# EAGLE design SparkFun_6DoF_LSM6DSV16X (EAGLE 9.6.2)
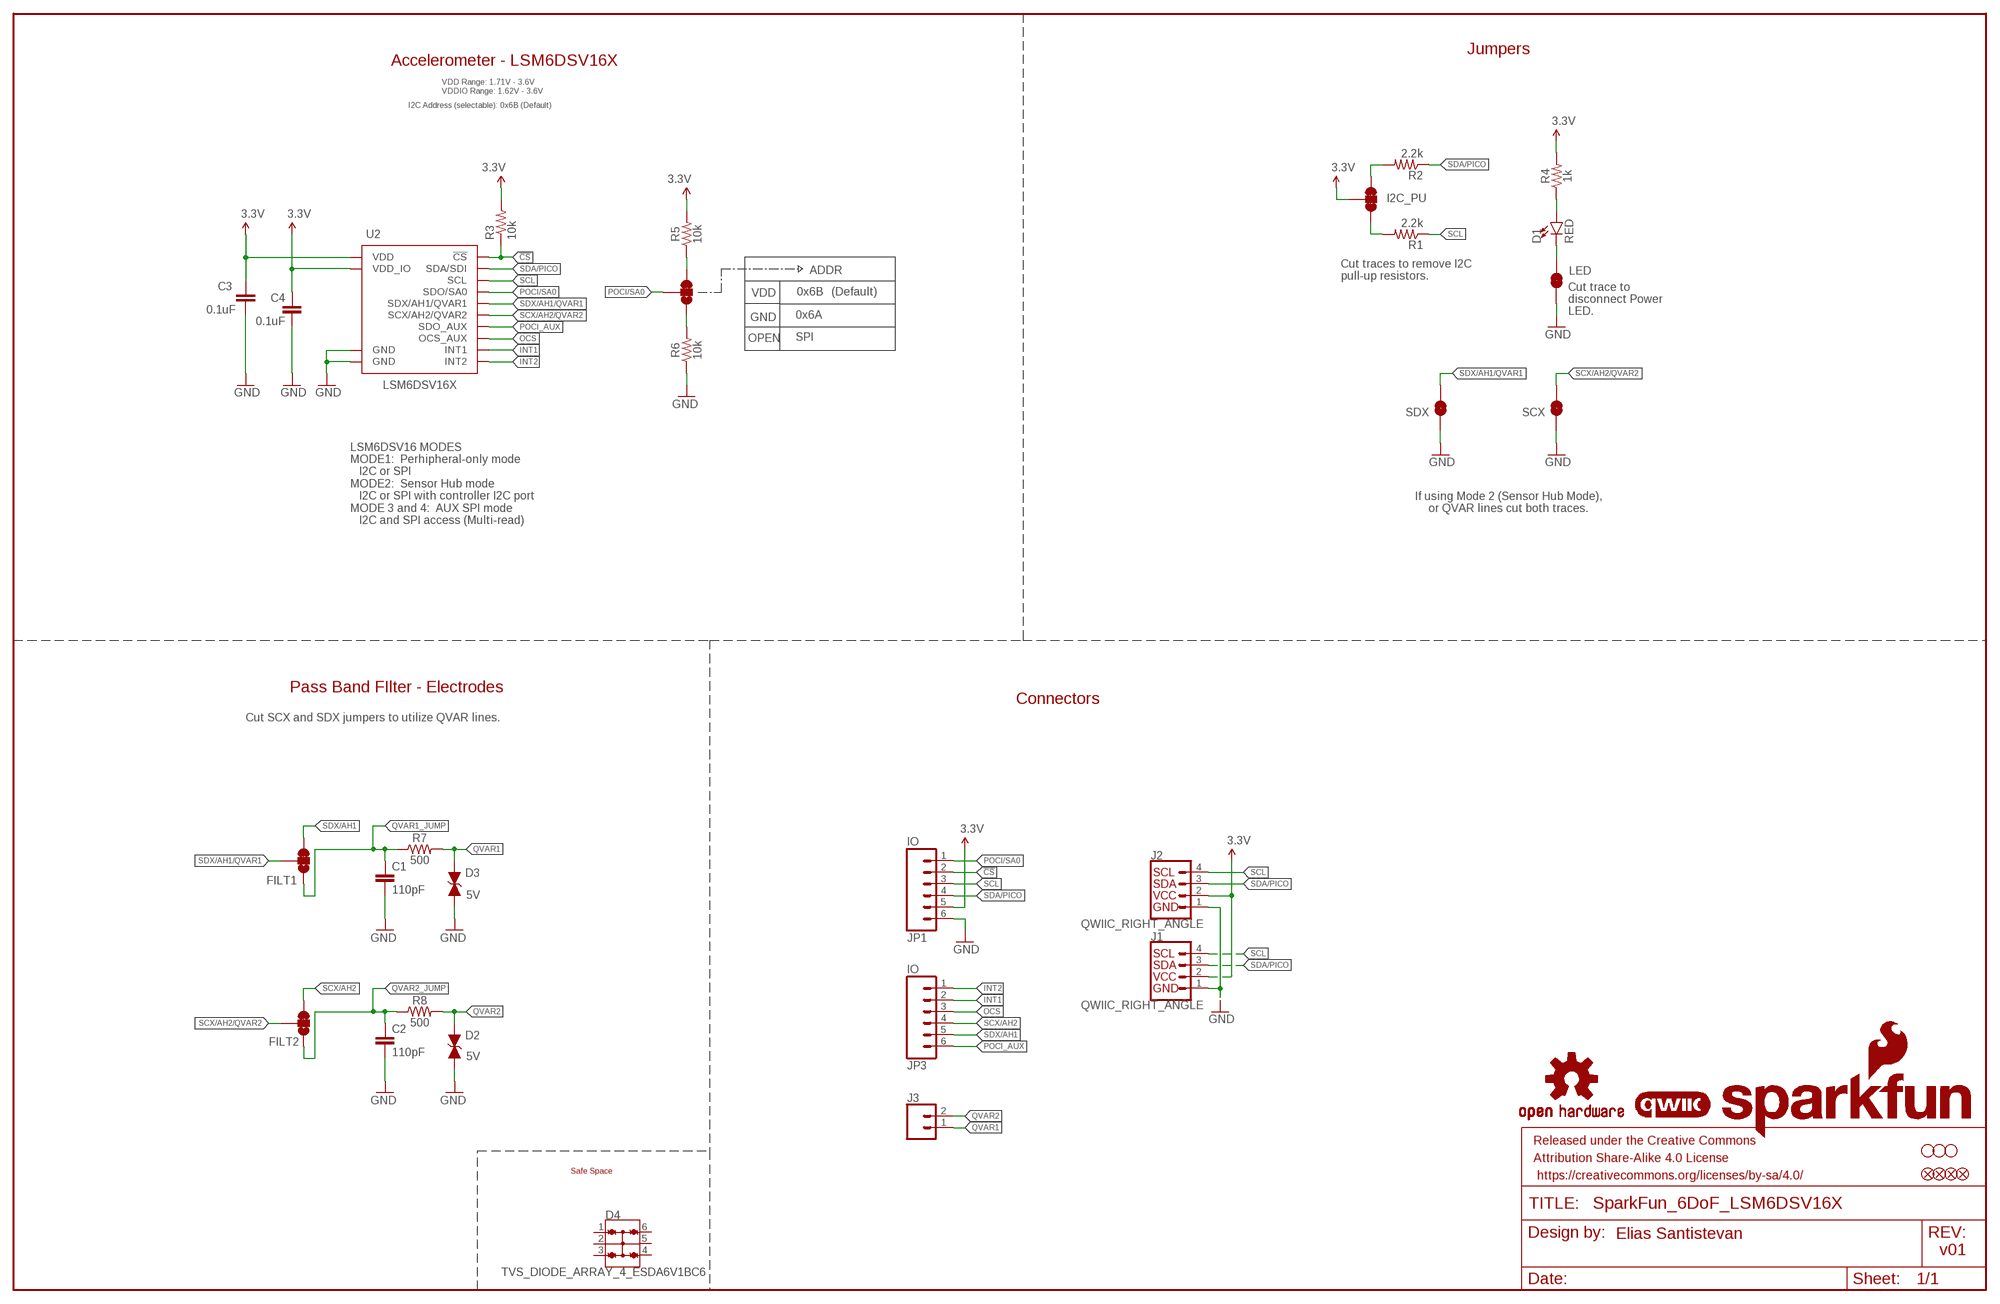
[diagram p0: schematic, sheet 1]

## Parts
ADDR  JUMPER-SMT_3_1-NC_TRACE_SILK  [SMT-JUMPER_3_1-NC_TRACE_SILK]
C1  110pF  110PF-0603-50V-5%  [0603]
C2  110pF  110PF-0603-50V-5%  [0603]
C3  0.1uF  0.1UF-0603-25V-(+80/-20%)  [0603]
C4  0.1uF  0.1UF-0603-25V-(+80/-20%)  [0603]
D1  RED  LED-RED0603  [LED-0603]
D2  5V  ESDALCL5-1BM2  [0603]
D3  5V  ESDALCL5-1BM2  [0603]
D4  TVS_DIODE_ARRAY_4_ESDA6V1BC6  [SOT23-6L]
FD1  FIDUCIALUFIDUCIAL  [FIDUCIAL-MICRO]
FD2  FIDUCIALUFIDUCIAL  [FIDUCIAL-MICRO]
FID1  FIDUCIALUFIDUCIAL  [FIDUCIAL-MICRO]
FID2  FIDUCIALUFIDUCIAL  [FIDUCIAL-MICRO]
FILT1  JUMPER-SMT_3_1-NC_TRACE_SILK  [SMT-JUMPER_3_1-NC_TRACE_SILK]
FILT2  JUMPER-SMT_3_1-NC_TRACE_SILK  [SMT-JUMPER_3_1-NC_TRACE_SILK]
FRAME2  FRAME-LEDGER  [CREATIVE_COMMONS]
I2C_PU  S_MODE  JUMPER-SMT_3_2-NC_TRACE_SILK  [SMT-JUMPER_3_2-NC_TRACE_SILK]
J1  QWIIC_RIGHT_ANGLE  QWIIC_CONNECTORJS-1MM  [JST04_1MM_RA]
J2  QWIIC_RIGHT_ANGLE  QWIIC_CONNECTORJS-1MM  [JST04_1MM_RA]
J3  CONN_021X02_NO_SILK  [1X02_NO_SILK]
JP1  IO  CONN_06NO_SILK_NO_POP  [1X06_NO_SILK]
JP3  IO  CONN_06NO_SILK_NO_POP  [1X06_NO_SILK]
LED  JUMPER-SMT_2_NC_TRACE_SILK  [SMT-JUMPER_2_NC_TRACE_SILK]
LOGO1  QWIIC_LOGO_4MM  [QWIIC_4MM]
LOGO2  OSHW-LOGOMINI  [OSHW-LOGO-MINI]
LOGO3  SFE_LOGO_NAME_FLAME.1_INCH  [SFE_LOGO_NAME_FLAME_.1]
R1  2.2k  2.2KOHM-0603-1/10W-1%  [0603]
R2  2.2k  2.2KOHM-0603-1/10W-1%  [0603]
R3  10k  10KOHM-0603-1/10W-1%  [0603]
R4  1k  1KOHM-0603-1/10W-1%  [0603]
R5  10k  10KOHM-0603-1/10W-1%  [0603]
R6  10k  10KOHM-0603-1/10W-1%  [0603]
R7  500  500OHM-0603-1/10W-1%  [0603]
R8  500  500OHM-0603-1/10W-1%  [0603]
SCX  JUMPER-SMT_2_NC_TRACE_SILK  [SMT-JUMPER_2_NC_TRACE_SILK]
SDX  JUMPER-SMT_2_NC_TRACE_SILK  [SMT-JUMPER_2_NC_TRACE_SILK]
STANDOFF1  STAND-OFFTIGHT  [STAND-OFF-TIGHT]
STANDOFF2  STAND-OFFTIGHT  [STAND-OFF-TIGHT]
STANDOFF3  STAND-OFFTIGHT  [STAND-OFF-TIGHT]
U2  LSM6DSV16X  [LGA-14L]

## Nets
3.3V: C3.1 C4.1 I2C_PU.2 J1.2 J2.2 JP1.5 R3.2 R4.2 R5.2 U2.P5(VDD_IO) U2.P8(VDD)
!CS!: JP1.2 R3.1 U2.P12(!CS!)
GND: C1.2 C2.2 C3.2 C4.2 D2.1(A) D3.1(A) J1.1 J2.1 JP1.6 LED.1 R6.1 SCX.1 SDX.1 U2.P6(GND) U2.P7(GND)
INT1: JP3.2 U2.P4(INT1)
INT2: JP3.1 U2.P9(INT2)
N$1: ADDR.3 R5.1
N$2: D1.A R4.1
N$3: D1.C LED.2
N$5: I2C_PU.1 R1.2
N$6: I2C_PU.3 R2.2
N$7: ADDR.1 R6.2
OCS: JP3.3 U2.P10(OCS_AUX)
POCI/SA0: ADDR.2 JP1.1 U2.P1(SDO/SA0)
POCI_AUX: JP3.6 U2.P11(SDO_AUX)
QVAR1: D3.2(C) J3.1 R7.2
QVAR1_JUMP: C1.1 FILT1.1 R7.1
QVAR2: D2.2(C) J3.2 R8.2
QVAR2_JUMP: C2.1 FILT2.1 R8.1
SCL: J1.4 J2.4 JP1.3 R1.1 U2.P13(SCL)
SCX/AH2: FILT2.3 JP3.4
SCX/AH2/QVAR2: FILT2.2 SCX.2 U2.P3(SCX/AH2/QVAR2)
SDA/PICO: J1.3 J2.3 JP1.4 R2.1 U2.P14(SDA/SDI)
SDX/AH1: FILT1.3 JP3.5
SDX/AH1/QVAR1: FILT1.2 SDX.2 U2.P2(SDX/AH1/QVAR1)
Unconnected: D4.1 D4.2 D4.3 D4.4 D4.5 D4.6

## Notes on the sheet
- Jumpers
- Accelerometer - LSM6DSV16X
- VDD Range: 1.71V - 3.6V
  VDDIO Range: 1.62V - 3.6V
- I2C Address (selectable): 0x6B (Default)
- Cut traces to remove I2C
  pull-up resistors.
- VDD | 0x6B | (Default)
- Cut trace to
  disconnect Power
  LED.
- GND | 0x6A
- OPEN | SPI
- LSM6DSV16 MODES
  MODE1:  Perhipheral-only mode
     I2C or SPI
  MODE2:  Sensor Hub mode
     I2C or SPI with controller I2C port
  MODE 3 and 4:  AUX SPI mode
     I2C and SPI access (Multi-read)
- If using Mode 2 (Sensor Hub Mode), 
  or QVAR lines cut both traces.
- Pass Band FIlter - Electrodes
- Connectors
- Cut SCX and SDX jumpers to utilize QVAR lines.
- Safe Space
- Elias Santistevan
- v01

## Library data of the parts
ADDR FILT1 FILT2 = SparkFun-Jumpers:JUMPER-SMT_3_1-NC_TRACE: Normally closed trace jumper (1 of 2 connections) This jumper has a trace between two pads so it's normally closed (NC). The other connection is normally open (NO). Use a razor knife to open the connection. For best results follow the IPC guidelines for cutting traces: Cutout at least 0.063 mm (0.005 in). Remove all loose material to clean up the cut area. Seal the cut with an approved epoxy. Reapply solder to reclose the connection, or to close the NO connection.
C1 C2 = lsm6dsv16x:110PF: 110pF/0.1nF ceramic capacitors A capacitor is a passive two-terminal electrical component used to store electrical energy temporarily in an electric field.; PROD_ID: CAP-07883
C3 C4 = SparkFun-Capacitors:0.1UF: 0.1µF ceramic capacitors A capacitor is a passive two-terminal electrical component used to store electrical energy temporarily in an electric field.; PROD_ID: CAP-00810
D1 = SparkFun-LED:LED-RED: Red SMD LED Used in manufacturing of most products at SparkFun Packages: 0603 - SMD 0603 package [Product Link] <http://docs.avagotech.com/docs/AV02-0551EN> 0603 SMART - SMD 0603 SMART package ( more efficient and expensive)[Product Link] <http://www.osram-os.com/Graphics/XPic2/00077099_0.pdf> 1206 - SMD1206 package [Product Link] <https://www.sparkfun.com/datasheets/DevTools/LilyPad/Q150OVS4.pdff> SparkFun Products: Pro Mini 328 -5V <https://www.sparkfun.com/products/821> RedBoard <https://www.sparkfun.com/products/12757> IOIO-OTG <https://www.sparkfun.com/products/13613>; PROD_ID: DIO-00819
D2 D3 = lsm6dsv16x:ESDALCL5-1BM2: ESDALCL5-1BM2 The ESDALCL5-1BM2 is a bidirectional single- line TVS diode designed to protect data lines or other I/O ports against ESD transients.
D4 = SparkFun-DiscreteSemi:TVS_DIODE_ARRAY_4; PROD_ID: DIO-14095
FD1 FD2 FID1 FID2 = SparkFun-Aesthetics:FIDUCIAL: Fiducial Alignment Points Point-of-reference for pick-and-place machines and other optical instruments.
FRAME2 = SparkFun-Aesthetics:FRAME-LEDGER: Schematic Frame - Ledger Standard 11x14 US Ledger frame
I2C_PU = SparkFun-Jumpers:JUMPER-SMT_3_2-NC_TRACE: Normally closed trace jumper (2 of 2 connections) This jumper has a trace between all three pads so they are normally closed (NC). Use a razor knife to open the connection(s). For best results follow the IPC guidelines for cutting traces: Cutout at least 0.063 mm (0.005 in). Remove all loose material to clean up the cut area. Seal the cut with an approved epoxy. Reapply solder to reclose the connection(s).
J1 J2 = SparkFun-Connectors:QWIIC_CONNECTOR: SparkFun I2C Standard Qwiic Connector An SMD 1mm pitch JST connector makes it easy and quick (get it? Qwiic?) to connect I2C devices to each other. The Qwiic system <http://www.sparkfun.com/qwiic> enables fast and solderless connection between popular platforms and various sensors and actuators. We carry 200mm <https://www.sparkfun.com/products/14204>, 100mm <https://www.sparkfun.com/products/14205>, 50mm <https://www.sparkfun.com/products/14206>, and breadboard friendly <https://www.sparkfun.com/products/14207> Qwiic cables. We also offer 10 pcs strips <https://www.sparkfun.com/products/14323> the SMD connectors.; PROD_ID: CONN-13694
J3 = SparkFun-Connectors:CONN_02: Multi connection point. Often used as Generic Header-pin footprint for 0.1 inch spaced/style header connections On any of the 0.1 inch spaced packages, you can populate with these: Break Away Headers - Straight <https://www.sparkfun.com/products/116> (PRT-00116) Break Away Male Headers - Right Angle <https://www.sparkfun.com/products/553> (PRT-00553) Female Headers <https://www.sparkfun.com/products/115> (PRT-00115) Break Away Headers - Machine Pin <https://www.sparkfun.com/products/117> (PRT-00117) Break Away Female Headers - Swiss Machine Pin <https://www.sparkfun.com/products/743> (PRT-00743) For SCREWTERMINALS and SPRING TERMINALS visit here: Screw Terimnals on SparkFun.com <https://www.sparkfun.com/search/results?term=Screw+Terminals> (5mm/3.5mm/2.54mm spacing) This device is also useful as a general connection point to wire up your design to another part of your project. Our various solder wires solder well into these plated through hole pads. Hook-Up Wire - Assortment (Stranded, 22 AWG) <https://www.sparkfun.com/products/11375> (PRT-11375) Hook-Up Wire - Assortment (Solid Core, 22 AWG) <https://www.sparkfun.com/products/11367> (PRT-11367) View the entire wire category on our website here <https://www.sparkfun.com/categories/141> Special notes: Molex polarized connector foot print use with: PRT-08233 with associated crimp pins and housings. 2.54_SCREWTERM for use with PRT-10571. 3.5mm Screw Terminal footprints for PRT-08084 5mm Screw Terminal footprints for use with PRT-08432
JP1 JP3 = SparkFun-Connectors:CONN_06: Multi connection point. Often used as Generic Header-pin footprint for 0.1 inch spaced/style header connections On any of the 0.1 inch spaced packages, you can populate with these: Break Away Headers - Straight <https://www.sparkfun.com/products/116> (PRT-00116) Break Away Male Headers - Right Angle <https://www.sparkfun.com/products/553> (PRT-00553) Female Headers <https://www.sparkfun.com/products/115> (PRT-00115) Break Away Headers - Machine Pin <https://www.sparkfun.com/products/117> (PRT-00117) Break Away Female Headers - Swiss Machine Pin <https://www.sparkfun.com/products/743> (PRT-00743) Arduino Stackable Header - 6 Pin <https://www.sparkfun.com/products/9280> (PRT-09280) Screw Terminals 2.54mm Pitch (6-Pin) <https://www.sparkfun.com/products/16499> (PRT-16499) For SCREWTERMINALS and SPRING TERMINALS visit here: Screw Terimnals on SparkFun.com <https://www.sparkfun.com/search/results?term=Screw+Terminals> (5mm/3.5mm/2.54mm spacing) This device is also useful as a general connection point to wire up your design to another part of your project. Our various solder wires solder well into these plated through hole pads. Hook-Up Wire - Assortment (Stranded, 22 AWG) <https://www.sparkfun.com/products/11375> (PRT-11375) Hook-Up Wire - Assortment (Solid Core, 22 AWG) <https://www.sparkfun.com/products/11367> (PRT-11367) View the entire wire category on our website here <https://www.sparkfun.com/categories/141>
LED SCX SDX = SparkFun-Jumpers:JUMPER-SMT_2_NC_TRACE: Normally closed trace jumper This jumper has a trace between two pads so it's normally closed (NC). Use a razor knife to open the connection. For best results follow the IPC guidelines for cutting traces: Cutout at least 0.063 mm (0.005 in). Remove all loose material to clean up the cut area. Seal the cut with an approved epoxy. Reapply solder to reclose the connection.
LOGO1 = SparkFun-Aesthetics:QWIIC_LOGO: Qwiic Logos for placement on schematic and PCB. The 5.5mm silk logo is best for placing next to Qwiic connector.
LOGO2 = SparkFun-Aesthetics:OSHW-LOGO: Open-Source Hardware (OSHW) Logo This logo indicates the piece of hardware it is found on incorporates a OSHW license and/or adheres to the definition of open source hardware found here: http://freedomdefined.org/OSHW
LOGO3 = SparkFun-Aesthetics:SFE_LOGO_NAME_FLAME: SparkFun Font Logo w/ Flame This is the SparkFun full logo. The logo on the schematic will always be the same size; the package variant is the height of the flame part of the logo. Default layer for the logo on the board is tSilk.
R1 R2 = SparkFun-Resistors:2.2KOHM: 2.2kΩ resistor A resistor is a passive two-terminal electrical component that implements electrical resistance as a circuit element. Resistors act to reduce current flow, and, at the same time, act to lower voltage levels within circuits. - Wikipedia; PROD_ID: RES-08272
R3 R5 R6 = SparkFun-Resistors:10KOHM: 10kΩ resistor A resistor is a passive two-terminal electrical component that implements electrical resistance as a circuit element. Resistors act to reduce current flow, and, at the same time, act to lower voltage levels within circuits. - Wikipedia; PROD_ID: RES-00824
R4 = SparkFun-Resistors:1KOHM: 1kΩ resistor A resistor is a passive two-terminal electrical component that implements electrical resistance as a circuit element. Resistors act to reduce current flow, and, at the same time, act to lower voltage levels within circuits. - Wikipedia; PROD_ID: RES-07856
R7 R8 = lsm6dsv16x:500OHM: 500Ω resistor A resistor is a passive two-terminal electrical component that implements electrical resistance as a circuit element. Resistors act to reduce current flow, and, at the same time, act to lower voltage levels within circuits. - Wikipedia
STANDOFF1-STANDOFF3 = SparkFun-Hardware:STAND-OFF: Stand Off Drill holes for mechanically mounting via screws, standoffs, etc. Note: Use the keepout ring to avoid running the screw head into surrounding components. Variant Overviews STAND-OFF - Mechanical footprint for a #4 phillips button head screw. STAND-OFF-TIGHT - Mechanical footprint for a #4 phillips button head screw, Example SparkFun Products Screw - Phillips Head (1/4", 4-40, 10 pack) <https://www.sparkfun.com/products/10453> (PRT-10453) Screw - Phillips Head (1/2", 4-40, 10 pack) <https://www.sparkfun.com/products/10452> (PRT-10452) Screw - Phillips Head (3/4", 4-40, 10 pack) <https://www.sparkfun.com/products/10451> (PRT-10451) Screw - Phillips Head (1", 4-40, 10 pack) <https://www.sparkfun.com/products/10450> (PRT-10450)
U2 = lsm6dsv16x:LSM6DSV16X: STMicroelectronic's LSM6DSV16X 6DoF The LSM6DSV16X is a high-performance, low-power 6-axis IMU, featuring a 3-axis digital accelerometer and a 3-axis digital gyroscope, with a triple core for processing acceleration and angular rate data on three separate channels (user interface, OIS, and EIS) with dedicated configuration, processing, and filtering. The LSM6DSV16X enables processes in edge computing, leveraging embedded advanced dedicated features such as a finite state machine (FSM) for configurable motion tracking and a machine learning core (MLC) for contextual awareness with exportable AI features for IoT applications. The LSM6DSV16X embeds Qvar (electric charge variation detection) for user interface functions like tap, double tap, triple tap, long press, or L/R – R/L swipe. The LSM6DSV16X embeds an analog hub able to connect an external analog input and convert it to a digital signal for processing. Product Page <https://www.st.com/en/mems-and-sensors/lsm6dsv16x.html#overview>; PROD_ID: IC-17274

## Board
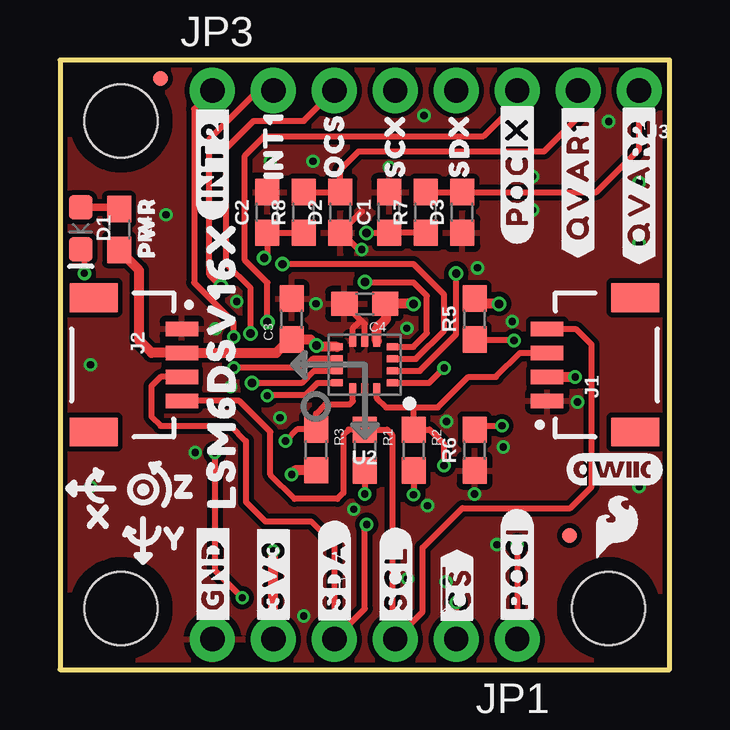
[diagram p1: board, top side]
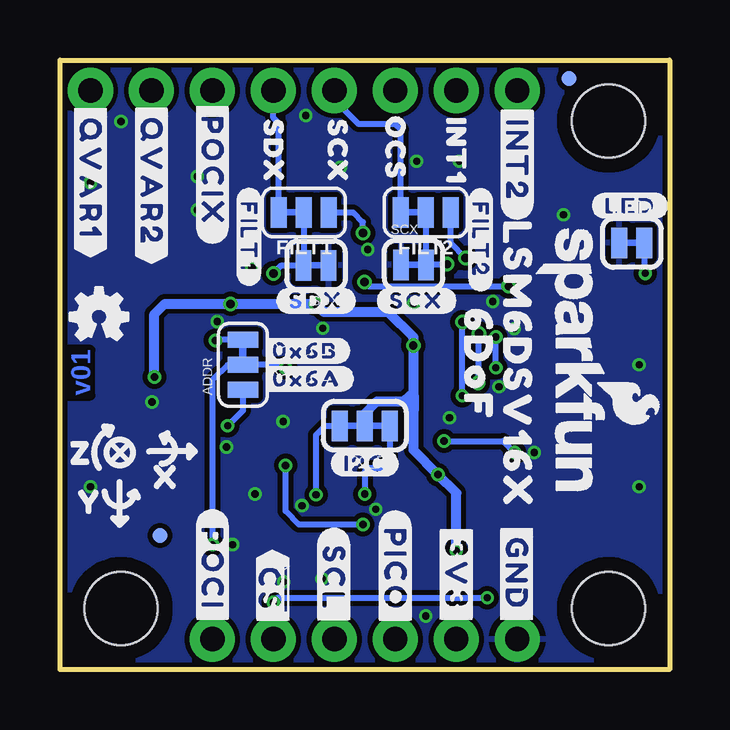
[diagram p2: board, bottom side, seen from below]

Size 25.4 x 25.4 mm. Coordinates in mm from the lower left corner, seen from the top.
Outline: 25.4,25.4 0,25.4 0,0 25.4,0 25.4,25.4
Copper layers (1*16): Top 0.035mm / dielectric 1.5mm / Bottom 0.035mm
Design rules "SparkFun-2-Layer-Minimum-JLCPCB": minimum track width 5mil, minimum drill 0.3mm, track to track 5mil, track to pad 5mil, pad to pad 5mil, via to via 5mil, smd to smd 5mil, copper to edge 7mil, drill to drill 7mil, minimum pad ring 5mil, minimum via ring 5mil, stop-mask expansion 2.5mil, vias tented up to drill 25mil, thermal gap 10mil
tRestrict: area 12.4,13.5 to 12.5,13.8

### Footprints (pad centres in the part's own frame; a part is rotated, then mirrored left to right if it is on the bottom)
SMT-JUMPER_3_1-NC_TRACE_SILK = smd 0.66 x 1.27: 1 -1.041,0; 2 0,0; 3 1.041,0
0603 = smd 1.1 x 1: 1 -0.85,0; 2 0.85,0
LED-0603 = smd 1 x 1: A -0.877,0; C 0.877,0
SOT23-6L = smd 0.6 x 1.2: 1 -0.95,-1.15; 2 0,-1.15; 3 0.95,-1.15; 4 0.95,1.15; 5 0,1.15; 6 -0.95,1.15
FIDUCIAL-MICRO = smd 0.635 x 0.635: 1 0,0
SMT-JUMPER_3_2-NC_TRACE_SILK = smd 0.66 x 1.27: 1 -1.041,0; 2 0,0; 3 1.041,0
JST04_1MM_RA = smd 0.6 x 1.35: 1 -1.5,0; 2 -0.5,0; 3 0.5,0; 4 1.5,0 | smd 1.2 x 2: NC1 2.8,-3.675; NC2 -2.8,-3.675
1X02_NO_SILK = drill 1.016 pad 1.88: 1 0,0; 2 2.54,0
1X06_NO_SILK = drill 1.016 pad 1.88: 1 0,0; 2 2.54,0; 3 5.08,0; 4 7.62,0; 5 10.16,0; 6 12.7,0
SMT-JUMPER_2_NC_TRACE_SILK = smd 0.66 x 1.27: 1 -0.521,0; 2 0.521,0
STAND-OFF-TIGHT = hole 3.048: 0,0
LGA-14L = smd 0.48 x 0.3: P1 -1.163,0.75; P2 -1.163,0.25; P3 -1.163,-0.25; P4 -1.163,-0.75; P8 1.163,-0.75; P9 1.163,-0.25; P10 1.163,0.25; P11 1.163,0.75 | smd 0.3 x 0.48: P5 -0.5,-1; P6 0,-1; P7 0.5,-1; P12 0.5,1; P13 0,1; P14 -0.5,1

### Placement (x,y rotation side)
ADDR  17.78,12.7 90 bottom
C1  13.72,19.05 90 top
C2  8.64,19.05 90 top
C3  9.65,14.61 90 top
C4  12.7,15.24 180 top
D1  0.86,18.39 270 top
D2  11.68,19.05 90 top
D3  16.76,19.05 90 top
D4  53.34,13.97 0 top  (outside the outline)
FD1  4.19,24.64 0 bottom
FD2  21.23,5.59 0 bottom
FID1  4.19,24.64 0 top
FID2  21.23,5.59 0 top
FILT1  15.24,19.05 180 bottom
FILT2  10.16,19.05 180 bottom
FRAME2  -17.78,-12.7 0 top  (outside the outline)
I2C_PU  12.7,10.16 180 bottom
J1  20.29,12.7 90 top
J2  5.08,12.7 270 top
J3  24.13,24.13 180 top
JP1  19.05,1.27 180 top
JP3  6.35,24.13 0 top
LED  1.57,17.78 0 bottom
LOGO1  23.11,8.33 0 top
LOGO2  23.77,14.71 0 bottom
LOGO3  4.12,12.83 270 bottom
R1  12.7,9.14 270 top
R2  14.73,9.14 270 top
R3  10.67,9.16 270 top
R4  2.46,18.34 270 top
R5  17.27,14.61 90 top
R6  17.27,9.14 90 top
R7  15.24,19.05 90 top
R8  10.16,19.05 90 top
SCX  10.67,16.87 0 bottom
SDX  14.73,16.84 180 bottom
STANDOFF1  2.54,22.86 0 top
STANDOFF2  2.54,2.54 0 top
STANDOFF3  22.86,2.54 0 top
U2  12.7,12.7 180 top
U$1  [#3V3#1]  8.89,3.96 90 top
U$2  [#GND#0]  6.38,3.99 90 top
U$3  [##CS##7]  16.54,3.35 90 top
U$4  [#SDA#4]  11.43,3.96 90 top
U$5  [#SCL#5]  14,3.81 90 top
U$6  [#POCI#11]  19.05,4.22 270 bottom
U$7  [INT16]  8.89,21.84 90 top
U$8  [#INT2#2]  6.35,21.21 270 bottom
U$9  [OCS17]  11.43,21.84 90 top
U$10  [SCX18]  13.97,21.84 90 top
U$11  [SDX19]  16.64,21.84 90 top
U$12  [#QVAR1#22]  21.59,20.45 90 top
U$13  [#0X6A#11]  15.11,12.12 0 bottom
U$14  [#0X6B#11]  15.19,13.28 0 bottom
U$15  [#3V3#1]  8.89,3.96 270 bottom
U$16  [#LED#11]  1.65,19.33 0 bottom
U$17  [#GND#0]  6.38,3.99 270 bottom
U$18  [#POCI#12]  19.05,4.22 90 top
U$19  [#QVAR2#22]  24.13,20.32 90 top
U$20  [#QVAR1#31]  24.13,20.45 270 bottom
U$21  [#QVAR2#31]  21.59,20.32 270 bottom
U$22  [#SCL#5]  14,3.81 270 bottom
U$23  [SCX18]  13.84,21.59 270 bottom
U$24  [#POCIX#8]  19.05,20.78 90 top
U$25  [#I2C#11]  12.7,8.59 0 bottom
U$26  [#PICO#13]  11.43,4.17 270 bottom
U$27  [##CS##8]  16.54,3.35 270 bottom
U$28  [PWR8]  3.61,18.41 90 top
U$29  [SFE_LOGO_FLAME_.1]  23.19,5.97 0 top
U$30  [SDX19]  16.51,21.59 270 bottom
U$31  [6DOF12]  7.98,12.7 270 bottom
U$32  [OCS17]  11.43,21.72 270 bottom
U$33  [#POCIX#7]  19.05,20.78 270 bottom
U$34  [X2114]  1.65,6.35 0 top
U$35  [Y2115]  4.83,5.46 0 top
U$36  [Z2116]  5.21,7.62 0 top
U$37  [X2114]  20.95,8 0 bottom
U$38  [Y2115]  24.13,6.99 0 bottom
U$39  [Z2116]  24.51,9.02 0 bottom
U$40  [#INT2#3]  6.35,21.21 90 top
U$41  [INT16]  8.89,21.59 270 bottom
U$42  [#SDX#20]  14.73,15.37 0 bottom
U$43  [#SCX#19]  10.54,15.37 0 bottom
U$44  [#FILT1#21]  17.53,18.03 270 bottom
U$45  [#FILT2#21]  7.87,17.91 270 bottom
U$46  [LSM6DSV16X37]  6.35,12.7 270 bottom
U$47  [LSM6DSV16X37]  6.73,12.7 90 top

### Tracks (layer width: path | path; a pad name or v marks a point on that pad's centre or on a via)
3.3V  (via drill 0.3, 0.35)
  Top 0.254: U2.P5 13.2,13.97 13.2,14.22
  Top 0.406: 13.59,15.24 13.59,14.6 13.2,14.22 U2.P5 | 13.59,15.24 C4.1 | JP1.5 v8.89,4.95 | J1.2 v21.45,12.2 v21.46,12.19 | v14.73,15.24 13.59,15.24 | R4.2 2.46,17.48 3.3,16.64 3.3,13.72 3.82,13.2 J2.2 9.02,13.2 9.57,13.76 C3.1 10.43,13.76 v10.68,13.51 10.74,13.45 U2.P8 | v18.29,15.24 17.49,15.24 R5.2 | R3.2 9.83,8.31 v9.65,8.13
  Bottom 0.406: v8.89,4.95 8.89,7.36 v9.65,8.13 10.67,9.14 10.67,10.79 | 10.67,10.79 11.05,11.18 | v21.46,12.19 21.46,14.81 21.03,15.24 v18.29,15.24 v14.73,15.24 14.4,14.91 11.73,14.91 10.67,13.84 | 10.67,11.43 10.67,13.84 | 10.67,11.43 10.67,10.79 | 11.05,11.18 10.79,11.43 10.67,11.43 | 10.67,13.84 10.68,13.83 v10.68,13.51 | 11.05,11.18 12.19,11.18 12.7,10.67 I2C_PU.2
!CS!  (via drill 0.3)
  Top 0.254: JP1.2 v16.51,2.79 | v6.45,9.04 6.45,4.14 v7.59,3 | U2.P12 12.2,11.18 12.06,11.05 11.05,11.05 10.67,10.67 R3.1 9.88,10.01 v9.4,9.53
  Bottom 0.254: v16.51,2.79 16.31,3 v7.59,3 | v9.4,9.53 6.93,9.53 v6.45,9.04
GND  (via drill 0.3)
  Top 0.254: U2.P7 12.2,14.23 12.53,14.56 | 12.57,19.09 D2.1 11.75,18.2 12.45,17.5 v12.57,17.5 | 12.53,14.56 12.7,14.39 U2.P6 | 12.53,14.56 C4.2
  other vias: 17.27,7.32 10.67,15.24 6.48,14.2 5.64,9.04 9.17,10.49 18.47,9.27 14.45,14.22 19.68,19.15 18.85,14.5 16.08,3.66 18.21,5.21 10.16,2.24 4.42,18.95 21.56,11.15 12.24,6.68 8.76,21.18 10.54,21.18 13.72,20.93 17.4,16.74 19.68,20.55 15.32,6.83 7.11,11.79 16.1,10.34 15.16,23.09 7.37,15.34 14.48,3.78 1.27,12.7 1.27,7.62 24.13,7.62 22.86,22.83 24.13,20.29 24.13,17.75
  pour Bottom (isolate 0.203): 25.4,0 25.4,25.4 0,25.4 0,0
  pour Top (isolate 0.203, rank 2): 25.4,0 25.4,25.4 0,25.4 0,0
INT1  (via drill 0.35)
  Top 0.254: U2.P4 14.72,13.45 15.29,14.02 15.29,15.57 14.73,16.13 12.7,16.13 v12.72,16.14 | v6.7,15.97 6.22,16.45 6.22,22.1 8.26,24.13 JP3.2
  Bottom 0.254: v12.72,16.14 12.55,15.98 v6.71,15.98 v6.7,15.97
INT2  (via drill 0.3)
  Top 0.254: v7.24,12.57 10.16,12.57 10.54,12.95 U2.P9 | v7.24,13.86 7.24,14.48 5.59,16.13 5.59,23.37 JP3.1
  Bottom 0.254: v7.24,12.57 v7.24,13.86
N$1  (via drill 0.3)
  Top 0.254: v18.92,13.72 17.31,13.72 R5.1
  Bottom 0.254: v18.92,13.72 18.9,13.74 ADDR.3
N$2
  Top 0.305: D1.A 2.39,19.27 R4.1
N$3  (via drill 0.3)
  Top 0.254: D1.C 1.02,17.36 v1.02,16.51
  Bottom 0.254: LED.2 1.05,16.55 v1.02,16.51
N$5  (via drill 0.3)
  Top 0.254: R1.2 v12.7,7.32
  Bottom 0.254: I2C_PU.1 11.66,8.79 12.06,8.38 12.57,8.38 12.7,8.26 v12.7,7.32
N$6  (via drill 0.3)
  Top 0.254: R2.2 v14.73,7.29
  Bottom 0.254: v14.73,7.29 14.73,9.78 14.35,10.16 I2C_PU.3
N$7  (via drill 0.3)
  Top 0.254: R6.2 17.44,10.16 v18.41,10.16
  Bottom 0.254: ADDR.1 17.78,10.79 v18.41,10.16
OCS  (via drill 0.35)
  Top 0.254: v7.99,11.94 10.07,11.94 10.58,12.45 U2.P10 | v7.95,14.01 7.95,15.9 6.94,16.91 6.94,21.72 8.08,22.86 10.16,22.86 JP3.3
  Bottom 0.254: v7.99,11.94 7.95,11.99 v7.95,14.01
POCI/SA0  (via drill 0.3)
  Top 0.254: v16,12.57 15.38,11.95 U2.P1 | v19.05,5.21 JP1.1
  Bottom 0.254: v16,12.57 16.14,12.7 ADDR.2 18.41,12.7 19.05,12.07 v19.05,5.21
POCI_AUX  (via drill 0.3, 0.35)
  Top 0.254: v8.64,11.41 8.66,11.43 10.22,11.43 10.74,11.95 U2.P11 | v8.64,14.48 8.64,16.13 7.7,17.07 7.7,21.41 8.51,22.23 17.65,22.23 19.05,23.62 JP3.6
  Bottom 0.254: v8.64,11.41 v8.64,14.48
QVAR1
  Top 0.254: R7.2 D3.2 22.35,19.9 24.13,21.68 J3.1
QVAR1_JUMP  (via drill 0.35)
  Top 0.254: R7.1 C1.1 13.7,18.19 v12.78,18.19
  Bottom 0.254: FILT1.1 13.18,19.05 12.78,18.64 v12.78,18.19
QVAR2
  Top 0.254: R8.2 D2.2 11.68,20.83 12.45,21.59 20.17,21.59 21.59,23.01 J3.2
QVAR2_JUMP  (via drill 0.35)
  Top 0.254: v8.51,17.14 8.64,17.27 C2.1 R8.1
  Bottom 0.254: v8.51,17.14 9.12,17.75 FILT2.1
SCL
  Top 0.254: J1.4 21.49,14.2 22.15,13.54 22.15,7.62 21.26,6.73 16.76,6.73 15.11,5.08 15.11,2.41 JP1.3 13.84,1.4 13.84,9.78 13.63,9.99 R1.1 | R1.1 12.03,9.99 11.81,9.78 11.81,7.37 11.56,7.11 9.78,7.11 8.76,8.13 8.76,9.91 7.47,11.2 J2.4 | U2.P13 R1.1
SCX/AH2
  Bottom 0.254: JP3.4 13.97,23.75 12.95,22.73 11.43,22.73 11.2,22.5 FILT2.3
SCX/AH2/QVAR2  (via drill 0.35)
  Top 0.254: U2.P3 14.83,12.95 16,14.12 16,15.62 14.73,16.89 v9.27,16.89
  Bottom 0.254: v9.27,16.89 9.3,16.87 SCX.2 FILT2.2
SDA/PICO  (via drill 0.3)
  Top 0.254: J1.3 19.17,13.2 18.16,12.19 17.02,12.19 15.75,10.92 14.73,10.92 | J2.3 4.2,12.2 3.81,11.81 3.81,10.54 4.19,10.16 7.11,10.16 7.75,9.53 7.75,6.99 8.56,6.17 10.46,6.17 11.43,5.21 JP1.4 12.7,2.54 12.7,5.97 v12.78,6.04 | v16,8.51 16,9.4 15.41,9.99 R2.1 14.73,10.92 | 14.73,10.92 13.59,10.92 13.2,11.31 U2.P14
  Bottom 0.254: v16,8.51 16,6.6 15.45,6.04 v12.78,6.04
SDX/AH1
  Bottom 0.254: JP3.5 16.51,22.99 16.28,22.76 FILT1.3
SDX/AH1/QVAR1  (via drill 0.35)
  Top 0.254: U2.P2 14.99,12.45 16.51,13.97 v16.51,16.51
  Bottom 0.254: v16.51,16.51 16.18,16.84 SDX.2 15.23,16.87 15.23,19.04 FILT1.2

### Text on the board
Bottom: v01
tDocu: Safe Space | Elias Santistevan